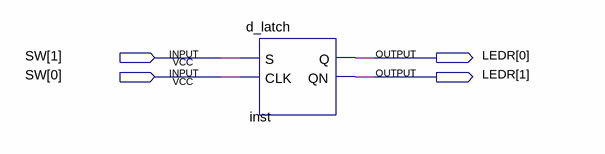
[diagram p0: schematic sheet]
// Quartus schematic part_b.bdf as structural Verilog: 1 symbols, 4 pins
module part_b (
  input  [1:0] SW,
  output [1:0] LEDR
);

  d_latch inst (.S(SW[1]), .CLK(SW[0]), .Q(LEDR[0]), .QN(LEDR[1]));
endmodule
